# Altium project opo.PrjPcb
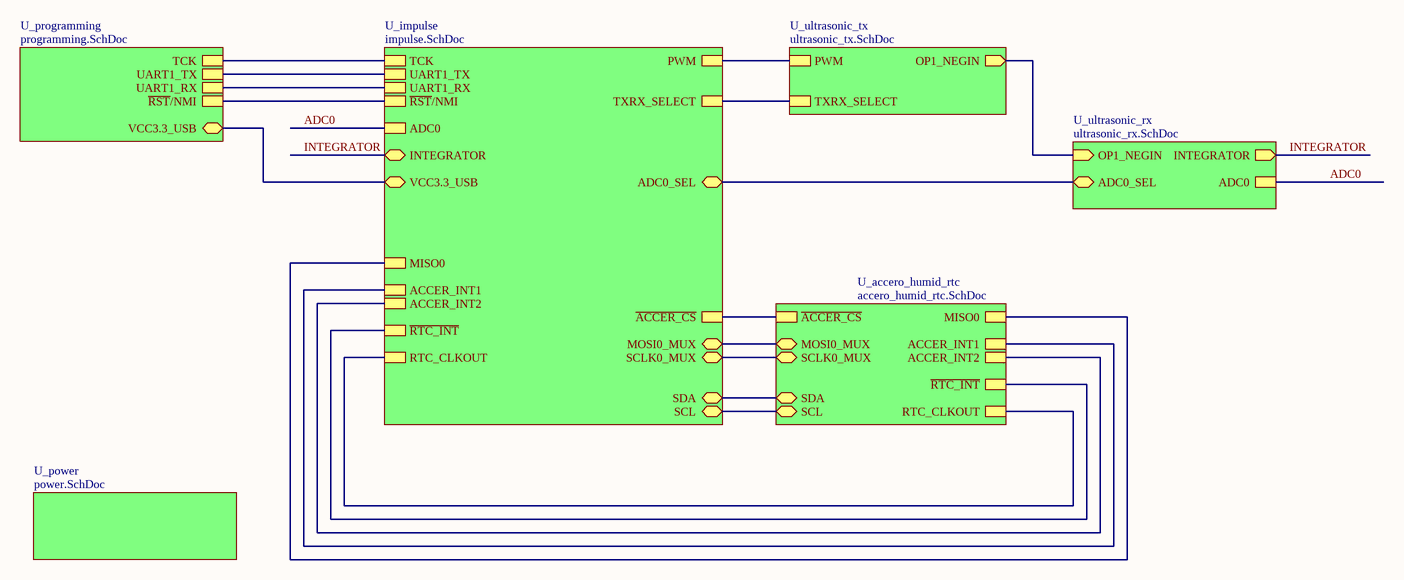
[diagram p0: opo_v4.1.SchDoc]
7 sheets, 106 parts. Net scope: hierarchical (ports join the sheet entries above them; power ports are global).
Board file: opo_v4.1.PcbDoc
Sheets:
  opo_v4.1.SchDoc
    U_impulse = impulse.SchDoc
    U_accero_humid_rtc = accero_humid_rtc.SchDoc
    U_power = power.SchDoc
    U_programming = programming.SchDoc
    U_ultrasonic_rx = ultrasonic_rx.SchDoc
    U_ultrasonic_tx = ultrasonic_tx.SchDoc

## Sheet opo_v4.1.SchDoc: OPO
size Letter; Author: Kuo, Huang; Revision: 4.0; SheetNumber: 3; SheetTotal: 7

### Sub-sheets
U_accero_humid_rtc = accero_humid_rtc.SchDoc: ~{ACCER_CS}, MISO0, ACCER_INT1, ACCER_INT2, ~{RTC_INT}, RTC_CLKOUT, SDA, SCL, MOSI0_MUX, SCLK0_MUX
U_impulse = impulse.SchDoc: TCK, UART1_TX, UART1_RX, ~{RST}/NMI, ADC0, TXRX_SELECT, PWM, ~{ACCER_CS}, MISO0, ACCER_INT1, ACCER_INT2, ~{RTC_INT}, RTC_CLKOUT, INTEGRATOR, ADC0_SEL, SDA, SCL, MOSI0_MUX, SCLK0_MUX, VCC3.3_USB
U_power = power.SchDoc: no entries
U_programming = programming.SchDoc: TCK, UART1_TX, UART1_RX, ~{RST}/NMI, VCC3.3_USB
U_ultrasonic_rx = ultrasonic_rx.SchDoc: ADC0, OP1_NEGIN (in), INTEGRATOR (out), ADC0_SEL
U_ultrasonic_tx = ultrasonic_tx.SchDoc: PWM, OP1_NEGIN (out), TXRX_SELECT

### Nets
ADC0: sheet U_impulse/ADC0, sheet U_ultrasonic_rx/ADC0
INTEGRATOR: sheet U_impulse/INTEGRATOR, sheet U_ultrasonic_rx/INTEGRATOR
MISO0: sheet U_impulse/MISO0, sheet U_accero_humid_rtc/MISO0
MOSI0_MUX: sheet U_impulse/MOSI0_MUX, sheet U_accero_humid_rtc/MOSI0_MUX
OP1_NEGIN: sheet U_ultrasonic_rx/OP1_NEGIN, sheet U_ultrasonic_tx/OP1_NEGIN
~{RST}/NMI: sheet U_impulse/~{RST}/NMI, sheet U_programming/~{RST}/NMI
SCL: sheet U_impulse/SCL, sheet U_accero_humid_rtc/SCL
SCLK0_MUX: sheet U_impulse/SCLK0_MUX, sheet U_accero_humid_rtc/SCLK0_MUX
SDA: sheet U_impulse/SDA, sheet U_accero_humid_rtc/SDA
TCK: sheet U_impulse/TCK, sheet U_programming/TCK
UART1_RX: sheet U_impulse/UART1_RX, sheet U_programming/UART1_RX
UART1_TX: sheet U_impulse/UART1_TX, sheet U_programming/UART1_TX
VCC3.3_USB: sheet U_impulse/VCC3.3_USB, sheet U_programming/VCC3.3_USB
NetU1_8: sheet U_impulse/~{ACCER_CS}, sheet U_accero_humid_rtc/~{ACCER_CS}
NetU1_9: sheet U_impulse/ACCER_INT2, sheet U_accero_humid_rtc/ACCER_INT2
NetU1_11: sheet U_impulse/ACCER_INT1, sheet U_accero_humid_rtc/ACCER_INT1
NetU4_2: sheet U_impulse/ADC0_SEL, sheet U_ultrasonic_rx/ADC0_SEL
NetU4_8: sheet U_impulse/RTC_CLKOUT, sheet U_accero_humid_rtc/RTC_CLKOUT
NetU4_18: sheet U_impulse/PWM, sheet U_ultrasonic_tx/PWM
NetU4_39: sheet U_impulse/~{RTC_INT}, sheet U_accero_humid_rtc/~{RTC_INT}
NetU4_44: sheet U_impulse/TXRX_SELECT, sheet U_ultrasonic_tx/TXRX_SELECT

### Notes on the sheet
- Title
- Date:
- Author:
- Revision:
- Sheet
- of
- University of Michigan
- File:

## Sheet impulse.SchDoc: OPO
size Letter; Author: Kuo, Huang; Revision: 4.0; SheetNumber: 2; SheetTotal: 7
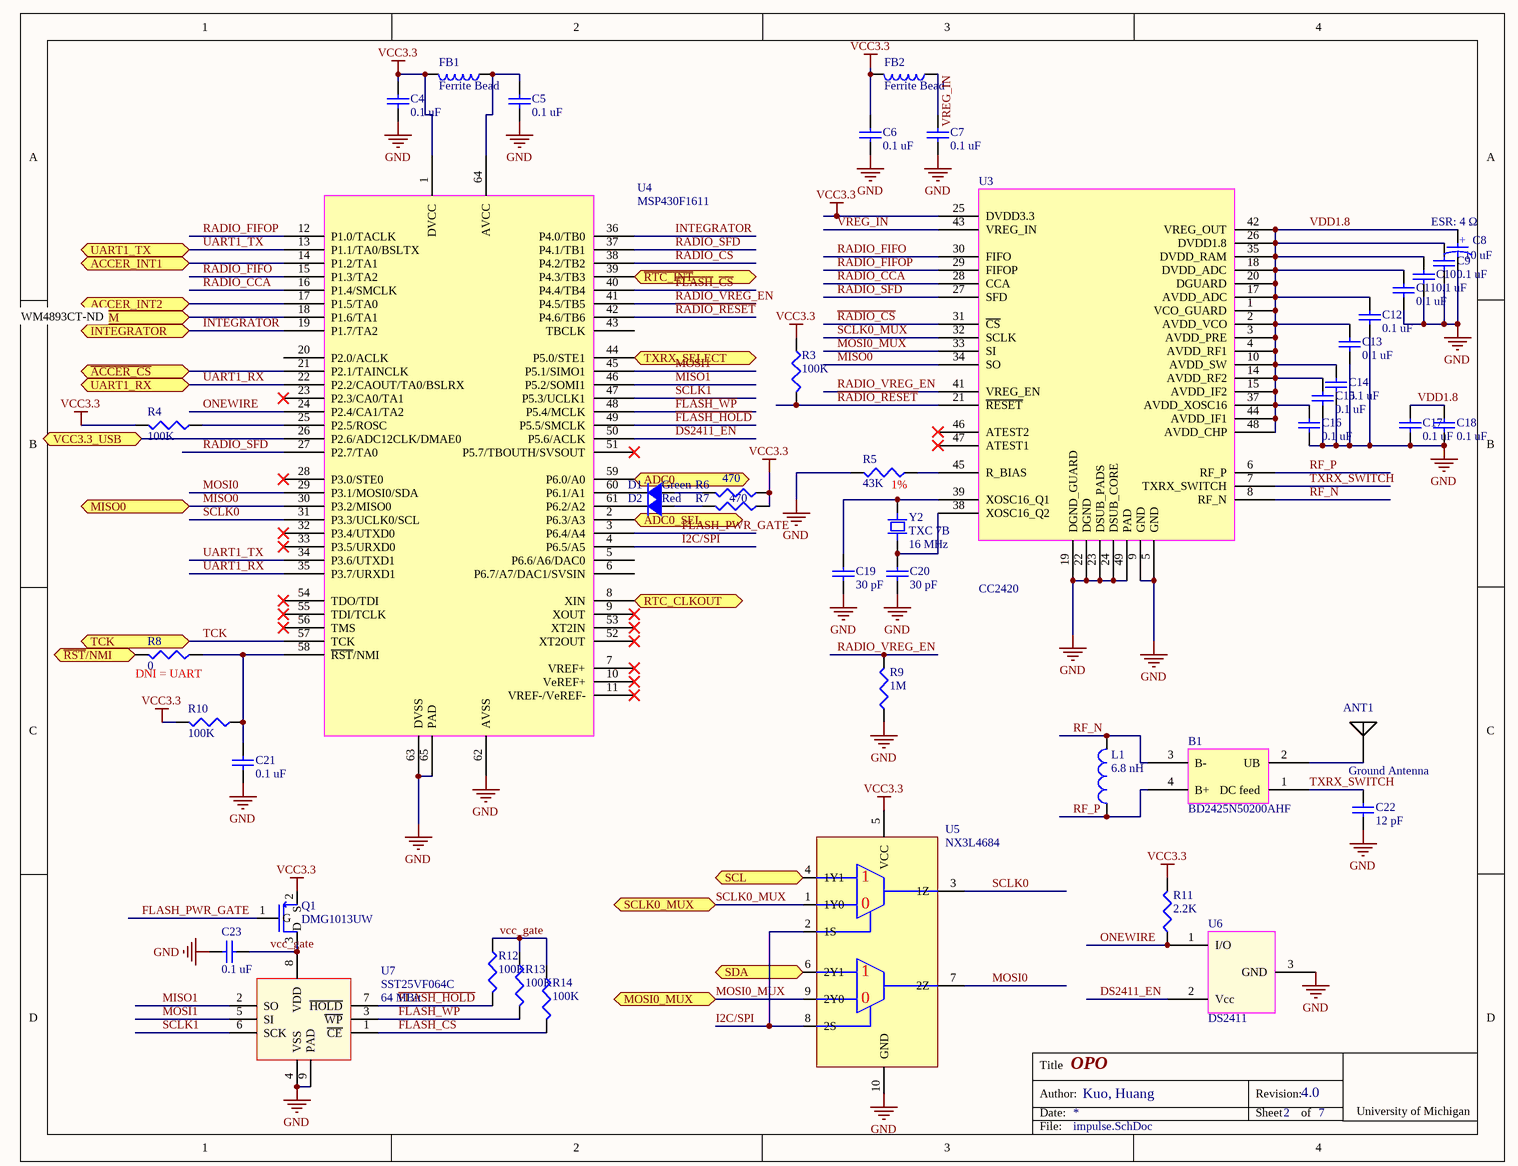
[diagram p1: impulse.SchDoc]

### Parts
ANT1  Ground Antenna  [Chip Antenna]
B1  BD2425N50200AHF  [BD2425N50200AHF]
C4  value 0.1 uF  [0402]  (hidden comment: Ceramic capacitor)
C5  value 0.1 uF  [0402]  (hidden comment: Ceramic capacitor)
C6  value 0.1 uF  [0402]  (hidden comment: Ceramic capacitor)
C7  value 0.1 uF  [0402]  (hidden comment: Ceramic capacitor)
C8  value 10 uF  ESR: 4 Ω  [0603 - Polar Marking]  (hidden comment: Tantalum capacitor)
C9  value 0.1 uF  [0402]  (hidden comment: Ceramic capacitor)
C10  value 0.1 uF  [0402]  (hidden comment: Ceramic capacitor)
C11  value 0.1 uF  [0402]  (hidden comment: Ceramic capacitor)
C12  value 0.1 uF  [0402]  (hidden comment: Ceramic capacitor)
C13  value 0.1 uF  [0402]  (hidden comment: Ceramic capacitor)
C14  value 0.1 uF  [0402]  (hidden comment: Ceramic capacitor)
C15  value 0.1 uF  [0402]  (hidden comment: Ceramic capacitor)
C16  value 0.1 uF  [0402]  (hidden comment: Ceramic capacitor)
C17  value 0.1 uF  [0402]  (hidden comment: Ceramic capacitor)
C18  value 0.1 uF  [0402]  (hidden comment: Ceramic capacitor)
C19  value 30 pF  [0402]  (hidden comment: Ceramic capacitor)
C20  value 30 pF  [0402]  (hidden comment: Ceramic capacitor)
C21  value 0.1 uF  [0402]  (hidden comment: Ceramic capacitor)
C22  value 12 pF  [0402]  (hidden comment: Ceramic capacitor)
C23  value 0.1 uF  [0402]  (hidden comment: Ceramic capacitor)
D1  Color: Green  [0402 - DIODE]  (hidden comment: LED, Green)
D2  Color: Red  [0402 - DIODE]  (hidden comment: LED, Red)
FB1  Ferrite Bead  [0402]
FB2  Ferrite Bead  [0402]
L1  value 6.8 nH  [0402]  (hidden comment: Chip inductor)
Q1  DMG1013UW  [SC70-3]
R3  value 100K  [0402]  (hidden comment: Chip resistor)
R4  value 100K  [0402]  (hidden comment: Chip resistor)
R5  value 43K  [0402]  (hidden comment: Chip resistor)
R6  value 470  [0402]  (hidden comment: Chip resistor)
R7  value 470  [0402]  (hidden comment: Chip resistor)
R8  value 0  [0402]  (hidden comment: Chip resistor)
R9  value 1M  [0402]  (hidden comment: Chip resistor)
R10  value 100K  [0402]  (hidden comment: Chip resistor)
R11  value 2.2K  [0402]  (hidden comment: Chip resistor)
R12  value 100K  [0402]  (hidden comment: Chip resistor)
R13  value 100K  [0402]  (hidden comment: Chip resistor)
R14  value 100K  [0402]  (hidden comment: Chip resistor)
U3  CC2420  [QFN50P700X700X100_HS-49N]
U4  MSP430F1611  [QFN50P900X900X90_HS-65N]
U5  NX3L4684  [QFN50P155X200X13-10N]
U6  DS2411  [SOT23-3N]
U7  SST25VF064C  Capacity: 64 MBit  [WSON]
Y2  TXC 7B  frequency: 16 MHz  [TXC 7B]

### Ports
ACCER_INT1, ACCER_INT2, ADC0, ADC0_SEL, INTEGRATOR, MISO0, MOSI0_MUX, PWM, RTC_CLKOUT, SCL, SCLK0_MUX, SDA, TCK, TXRX_SELECT, UART1_RX, UART1_TX, VCC3.3_USB, ~{ACCER_CS}, ~{RST}/NMI, ~{RTC_INT}

### Nets
GND: C4.2 C5.2 C6.2 C7.2 C8.2 C9.2 C10.2 C11.2 C12.2 C13.2 C14.2 C15.2 C16.2 C17.2 C18.2 C19.1 C20.1 C21.2 C22.2 C23.2 R5.1 R9.2 U3.5(GND) U3.9(GND) U3.19(DGND_GUARD) U3.22(DGND) U3.23(DSUB_PADS) U3.24(DSUB_CORE) U3.49(PAD) U4.62(AVSS) U4.63(DVSS) U4.65(PAD) U5.10(GND) U6.3(GND) U7.4(VSS) U7.9(PAD)
VCC3.3: C4.1 C6.1 FB1.1 FB2.1 Q1.2(S) R3.2 R4.1 R6.2 R7.2 R10.1 R11.1 U3.25(DVDD3.3) U4.1(DVCC) U5.5(VCC)
ADC0: U4.59(P6.0/A0) ; port ADC0
DS2411_EN: U4.50(P5.6/ACLK) U6.2(Vcc)
~{FLASH_HOLD}: R12.1 U4.49(P5.5/SMCLK) U7.7(~{HOLD})
~{FLASH_WP}: R13.1 U4.48(P5.4/MCLK) U7.3(~{WP})
~{FLASH}_~{CS}: R14.1 U4.40(P4.4/TB4) U7.1(~{CE})
FLASH_PWR_GATE: Q1.1(G) U4.3(P6.4/A4)
I2C/SPI: U4.4(P6.5/A5) U5.2(1S) U5.8(2S)
INTEGRATOR: U4.19(P1.7/TA2) U4.36(P4.0/TB0) ; port INTEGRATOR
MISO0: U3.34(SO) U4.30(P3.2/MISO0) ; port MISO0
MISO1: U4.46(P5.2/SOMI1) U7.2(SO)
MOSI0: U4.29(P3.1/MOSI0/SDA) U5.7(2Z)
MOSI0_MUX: U3.33(SI) U5.9(2Y0) ; port MOSI0_MUX
MOSI1: U4.45(P5.1/SIMO1) U7.5(SI)
ONEWIRE: R11.2 U4.24(P2.4/CA1/TA2) U6.1(I/O)
~{RADIO_CS}: U3.31(~{CS}) U4.38(P4.2/TB2)
~{RADIO_RESET}: R3.1 U3.21(~{RESET}) U4.42(P4.6/TB6)
~{RST}/NMI: R8.1 ; port ~{RST}/NMI
RADIO_CCA: U3.28(CCA) U4.16(P1.4/SMCLK)
RADIO_FIFO: U3.30(FIFO) U4.15(P1.3/TA2)
RADIO_FIFOP: U3.29(FIFOP) U4.12(P1.0/TACLK)
RADIO_SFD: U3.27(SFD) U4.27(P2.7/TA0) U4.37(P4.1/TB1)
RADIO_VREG_EN: R9.1 U3.41(VREG_EN) U4.41(P4.5/TB5)
RF_N: B1.3(B-) L1.1 U3.8(RF_N)
RF_P: B1.4(B+) L1.2 U3.6(RF_P)
SCL: U5.4(1Y1) ; port SCL
SCLK0: U4.31(P3.3/UCLK0/SCL) U5.3(1Z)
SCLK0_MUX: U3.32(SCLK) U5.1(1Y0) ; port SCLK0_MUX
SCLK1: U4.47(P5.3/UCLK1) U7.6(SCK)
SDA: U5.6(2Y1) ; port SDA
TCK: U4.57(TCK) ; port TCK
TXRX_SWITCH: B1.1(DC_feed) C22.1 U3.7(TXRX_SWITCH)
UART1_RX: U4.22(P2.2/CAOUT/TA0/BSLRX) U4.35(P3.7/URXD1) ; port UART1_RX
UART1_TX: U4.13(P1.1/TA0/BSLTX) U4.34(P3.6/UTXD1) ; port UART1_TX
VCC3.3_USB: U4.26(P2.6/ADC12CLK/DMAE0) ; port VCC3.3_USB
vcc_gate: C23.1 Q1.3(D) R12.2 R13.2 R14.2 U7.8(VDD)
VDD1.8: C8.1 C9.1 C10.1 C11.1 C12.1 C13.1 C14.1 C15.1 C16.1 C17.1 C18.1 U3.1(VCO_GUARD) U3.2(AVDD_VCO) U3.3(AVDD_PRE) U3.4(AVDD_RF1) U3.10(AVDD_SW) U3.14(AVDD_RF2) U3.15(AVDD_IF2) U3.17(AVDD_ADC) U3.18(DVDD_ADC) U3.20(DGUARD) U3.26(DVDD1.8) U3.35(DVDD_RAM) U3.37(AVDD_XOSC16) U3.42(VREG_OUT) U3.44(AVDD_IF1) U3.48(AVDD_CHP)
VREG_IN: C7.1 FB2.2 U3.43(VREG_IN)
NetANT1_1: ANT1.1 B1.2(UB)
NetC5_1: C5.1 FB1.2 U4.64(AVCC)
NetC19_2: C19.2 U3.39(XOSC16_Q1) Y2.1
NetC20_2: C20.2 U3.38(XOSC16_Q2) Y2.3
NetC21_1: C21.1 R8.2 R10.2 U4.58(~{RST}/NMI)
NetD1_1: D1.1 R6.1
NetD1_2: D1.2 U4.60(P6.1/A1)
NetD2_1: D2.1 R7.1
NetD2_2: D2.2 U4.61(P6.2/A2)
NetR4_2: R4.2 U4.25(P2.5/ROSC)
NetR5_2: R5.2 U3.45(R_BIAS)
NetU1_8: U4.21(P2.1/TAINCLK) ; port ~{ACCER_CS}
NetU1_9: U4.17(P1.5/TA0) ; port ACCER_INT2
NetU1_11: U4.14(P1.2/TA1) ; port ACCER_INT1
NetU4_2: U4.2(P6.3/A3) ; port ADC0_SEL
NetU4_8: U4.8(XIN) ; port RTC_CLKOUT
NetU4_18: U4.18(P1.6/TA1) ; port PWM
NetU4_39: U4.39(P4.3/TB3) ; port ~{RTC_INT}
NetU4_44: U4.44(P5.0/STE1) ; port TXRX_SELECT

Not connected (* = marked no-connect by the designer): U3 46(ATEST2)* 47(ATEST1)*; U4 5(P6.6/A6/DAC0) 6(P6.7/A7/DAC1/SVSIN) 7(VREF+)* 9(XOUT)* 10(VeREF+)* 11(VREF-/VeREF-)* 20(P2.0/ACLK) 23(P2.3/CA0/TA1)* 28(P3.0/STE0)* 32(P3.4/UTXD0)* 33(P3.5/URXD0)* 43(TBCLK) 51(P5.7/TBOUTH/SVSOUT)* 52(XT2OUT)* 53(XT2IN)* 54(TDO/TDI)* 55(TDI/TCLK)* 56(TMS)*

### Notes on the sheet
- WM4893CT-ND
- (near R5) 1%
- (near R8) DNI = UART
- Title
- Date:
- Author:
- Revision:
- Sheet
- of
- University of Michigan
- File:
- (in symbol C_10u_0603_tantalum) +
- (in symbol NX3L4684) 0

### Library data of the parts
ANT1 = Ground Antenna: 2.4GHz Surface Mount Device (SMD) On Ground Antenna, 50 Ohms; Supplier 1: Digi-Key; Supplier Part Number 1: WM4893CT-ND
B1 = BD2425N50200AHF: Ultra Low Profile 0404 Balun   50Ω to 200Ω Balanced; Supplier 1: Digi-Key; Supplier Part Number 1: 1173-1063-1-ND
C4-C7 C9-C18 C21 C23 = C_0.1u_0402_ceramic: Ceramic capacitor, 0.1u, 0402 package; Manufacture: TDK; voltage rated: 10 V; tolerance: 10%; Supplier 1: Digi-Key; Supplier Part Number 1: 445-1265-1-ND; package: 0402
C8 = C_10u_0603_tantalum: Tantalum capacitor, 10 uF, 0603 package; Manufacture: AVX; voltage rated: 6.3V; tolerance: 10%; package: 0603; Supplier 1: Digi-Key; Supplier Part Number 1: 478-4959-1-ND
C19 C20 = C_30p_0402_ceramic: Ceramic capacitor, 30 pF, 0402 package; Manufacture: Johanson; voltage rated: 50 V; tolerance: 2%; package: 0402; Supplier 1: Digi-Key; Supplier Part Number 1: 712-1295-1-ND
C22 = C_12p_0402_ceramic: Ceramic capacitor, 12 pF, 0402 package; Manufacture: Johanson; voltage rated: 50 V; tolerance: 2%; package: 0402; Supplier 1: Digi-Key; Supplier Part Number 1: 712-1256-1-ND
D1 = D_LED_GREEN_0402: LED, Green,  0402; package: 0402; Supplier 1: Digi-Key; Supplier Part Number 1: 511-1592-1-ND
D2 = D_LED_RED_0402: LED, Red, 0402; package: 0402; Supplier 1: Digi-Key; Supplier Part Number 1: 511-1593-1-ND
FB1 FB2 = FB_150mA_0402: Ferrite Bead, 150 mA, 0402 package; impedance@Freq: 1K@100 MHz; current rating: 150 mA; Supplier 1: Digi-Key; Supplier Part Number 1: 587-1835-1-ND; package: 0402
L1 = L_6.8n_0402: Chip inductor, 6.8 nH, 0402 package; tolerance: 5%; package: 0402; Supplier 1: Digi-Key; Supplier Part Number 1: 712-1419-1-ND
Q1 = DMG1013UW: P-CHANNEL ENHANCEMENT MODE MOSFET; Supplier 1: Digi-Key; Supplier Part Number 1: DMG1013UW-7DICT-ND
R3 R4 R10 R12-R14 = R_100K_0402: Chip resistor, 100K, 0402 package; tolerance: 1%; power: 1/16 W; Supplier 1: Digi-Key; Supplier Part Number 1: 541-100KLCT-ND; package: 0402
R5 = R_43K_0402: Chip resistor, 43K, 0402 package; tolerance: 1%; power: 1/16 W; Supplier 1: Digi-Key; Supplier Part Number 1: 541-43.0KLCT-ND; package: 0402
R6 R7 = R_470_0402: Chip resistor, 470, 0402 package; tolerance: 1%; power: 1/16 W; Supplier 1: Digi-Key; Supplier Part Number 1: 541-470LCT-ND; package: 0402
R8 = R_0_0402: Chip resistor, 0, 0402 package; package: 0402; Supplier 1: Digi-Key; Supplier Part Number 1: 541-0.0YBCT-ND
R9 = R_1M_0402: Chip resistor, 1M, 0402 package; tolerance: 1%; power: 1/16 W; Supplier 1: Digi-Key; Supplier Part Number 1: 541-1.00MLCT-ND; package: 0402
R11 = R_2.2K_0402: Chip resistor, 2.2K, 0402 package; tolerance: 1%; power: 1/16 W; package: 0402; Supplier 1: Digi-Key; Supplier Part Number 1: 541-2.20KLCT-ND
U3 = CC2420: 2.4 GHz IEEE 802.15.4 / ZigBee-ready RF Transceiver; Supplier 1: Digi-Key; Supplier Part Number 1: 296-19585-1-ND
U4 = MSP430F1611: MIXED SIGNAL MICROCONTROLLER; Supplier 1: Digi-Key; Supplier Part Number 1: 296-18102-1-ND
U5 = NX3L4684: IC ANALOG SWITCH SPDT 10XQFN; Supplier 1: Digi-Key; Supplier Part Number 1: 568-5564-1-ND
U6 = DS2411: Silicon Serial Number with VCC Input; Supplier 1: Digi-Key; Supplier Part Number 1: DS2411R+CT-ND
U7 = SST25VF064C: 64 Mbit SPI Serial Dual I/O Flash; Supplier 1: Digi-Key; Supplier Part Number 1: SST25VF064C-80-4I-Q2AE-CT-ND
Y2 = TXC 7B: 5 x 3.2 mm SMD SEAM CRYSTAL 7B SERIES; Load capatance: 18 pF; ESR: 40; stability: 30 ppm; Supplier 1: Digi-Key; Supplier Part Number 1: 887-1104-1-ND

## Sheet accero_humid_rtc.SchDoc: OPO
size Letter; Author: Kuo, Huang; Revision: 4.0; SheetNumber: 1; SheetTotal: 7
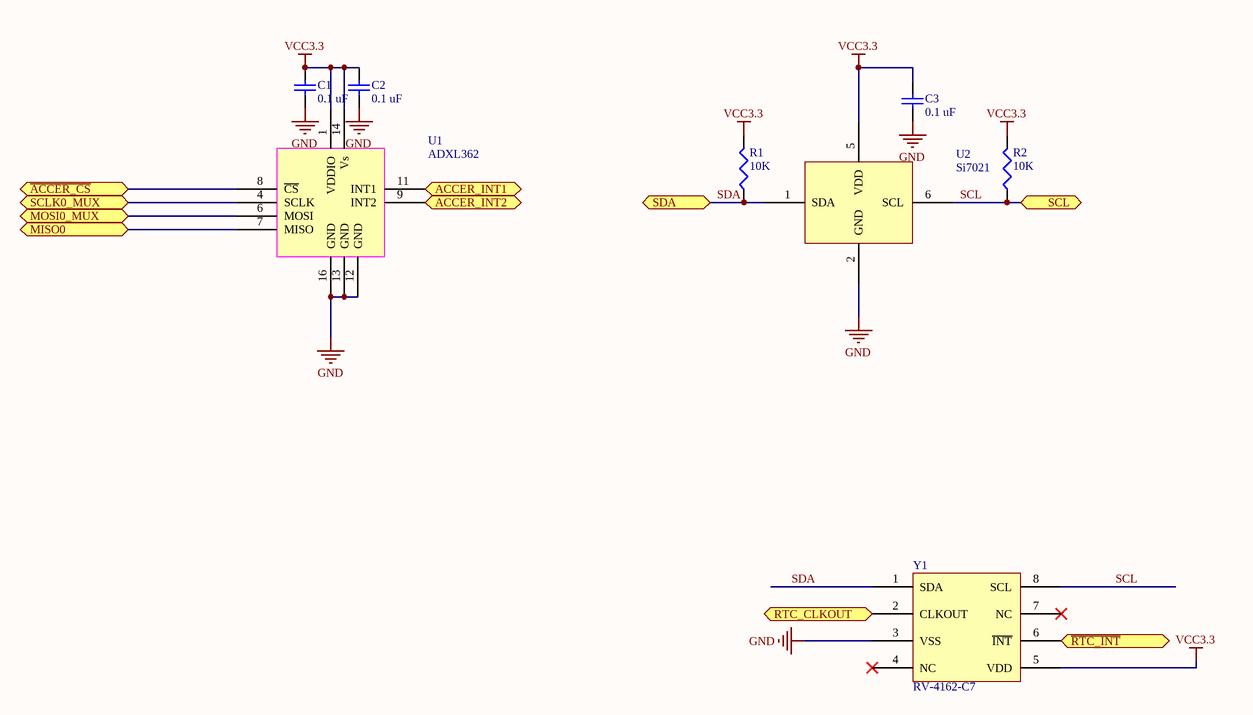
[diagram p2: accero_humid_rtc.SchDoc]

### Parts
C1  value 0.1 uF  [0402]  (hidden comment: Ceramic capacitor)
C2  value 0.1 uF  [0402]  (hidden comment: Ceramic capacitor)
C3  value 0.1 uF  [0402]  (hidden comment: Ceramic capacitor)
R1  value 10K  [0402]  (hidden comment: Chip resistor)
R2  value 10K  [0402]  (hidden comment: Chip resistor)
U1  ADXL362  [LGA_CC-16-4]
U2  Si7021  [DFN6-Si7021]
Y1  RV-4162-C7  [RV4162]

### Ports
ACCER_INT1, ACCER_INT2, MISO0, MOSI0_MUX, RTC_CLKOUT, SCL, SCLK0_MUX, SDA, ~{ACCER_CS}, ~{RTC_INT}

### Nets
GND: C1.2 C2.2 C3.2 U1.12(GND) U1.13(GND) U1.16(GND) U2.2(GND) Y1.3(VSS)
VCC3.3: C1.1 C2.1 C3.1 R1.1 R2.1 U1.1(VDDIO) U1.14(Vs) U2.5(VDD) Y1.5(VDD)
MISO0: U1.7(MISO) ; port MISO0
MOSI0_MUX: U1.6(MOSI) ; port MOSI0_MUX
SCL: R2.2 U2.6(SCL) Y1.8(SCL) ; port SCL
SCLK0_MUX: U1.4(SCLK) ; port SCLK0_MUX
SDA: R1.2 U2.1(SDA) Y1.1(SDA) ; port SDA
NetU1_8: U1.8(~{CS}) ; port ~{ACCER_CS}
NetU1_9: U1.9(INT2) ; port ACCER_INT2
NetU1_11: U1.11(INT1) ; port ACCER_INT1
NetU4_8: Y1.2(CLKOUT) ; port RTC_CLKOUT
NetU4_39: Y1.6(~{INT}) ; port ~{RTC_INT}

Not connected (* = marked no-connect by the designer): U2 3(DNC) 4(DNC) 7(DNC); Y1 4(NC)* 7(NC)*

### Notes on the sheet
- Title
- Date:
- Author:
- Revision:
- Sheet
- of
- University of Michigan
- File:

### Library data of the parts
C1-C3 = C_0.1u_0402_ceramic: as C4 on sheet impulse; Supplier 1: Digi-Key; Supplier Part Number 1: 445-1265-1-ND; package: 0402
R1 R2 = R_10K_0402: Chip resistor, 10K, 0402 package; tolerance: 1%; power: 1/16 W; Supplier 1: Digi-Key; Supplier Part Number 1: 541-10.0KLDKR-ND; package: 0402
U1 = ADXL362: Micropower, 3-Axis, ±2 g/±4 g/±8 g  Digital Output MEMS Accelerometer; Supplier 1: Digi-Key; Supplier Part Number 1: ADXL362BCCZ-RL7CT-ND
U2 = Si7021: Temperature and Humidity Sensor; Supplier 1: Digikey; Supplier Part Number 1: 336-2542-1-ND
Y1 = RV-4162-C7: Real Time Clock Module with I2C Bus; Supplier 1: Newark; Supplier Part Number 1: 09X0517

## Sheet power.SchDoc: OPO
size Letter; Author: Kuo, Huang; Revision: 4.0; SheetNumber: 4; SheetTotal: 7
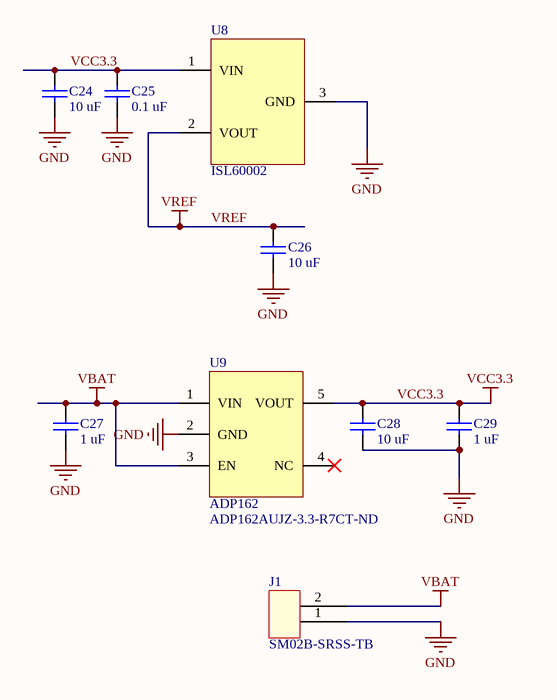
[diagram p3: power.SchDoc]

### Parts
C24  value 10 uF  [0603]  (hidden comment: Ceramic capacitor)
C25  value 0.1 uF  [0402]  (hidden comment: Ceramic capacitor)
C26  value 10 uF  [0603]  (hidden comment: Ceramic capacitor)
C27  value 1 uF  [0402]  (hidden comment: Ceramic capacitor)
C28  value 10 uF  [0603]  (hidden comment: Ceramic capacitor)
C29  value 1 uF  [0402]  (hidden comment: Ceramic capacitor)
J1  SM02B-SRSS-TB  [JST SH series]
U8  ISL60002  [SOT23-3N]
U9  ADP162  Supplier Part Number 1: ADP162AUJZ-3.3-R7CT-ND  [TSOT23-5]

### Nets
GND: C24.2 C25.2 C26.2 C27.2 C28.2 C29.2 J1.1 U8.3(GND) U9.2(GND)
VBAT: C27.1 J1.2 U9.1(VIN) U9.3(EN)
VCC3.3: C24.1 C25.1 C28.1 C29.1 U8.1(VIN) U9.5(VOUT)
VREF: C26.1 U8.2(VOUT)

Not connected (* = marked no-connect by the designer): U9 4(NC)*

### Notes on the sheet
- Title
- Date:
- Author:
- Revision:
- Sheet
- of
- University of Michigan
- File:

### Library data of the parts
C24 C26 C28 = C_10u_0603_ceramic: Ceramic capacitor, 10 uF, 0603 package; Manufacture: TDK; voltage rated: 6.3V; tolerance: 20%; package: 0603; Supplier 1: Digi-Key; Supplier Part Number 1: 445-4112-1-ND
C25 = C_0.1u_0402_ceramic: as C4 on sheet impulse; Supplier 1: Digi-Key; Supplier Part Number 1: 445-1265-1-ND; package: 0402
C27 C29 = C_1u_0402_ceramic: Ceramic capacitor, 1 uF, 0402 package; Manufacture: TDK; voltage rated: 6.3 V; tolerance: 10%; package: 0402; Supplier 1: Digi-Key; Supplier Part Number 1: 445-5000-1-ND
J1 = SM02B-SRSS-TB: CONN HEADER SH 2POS SIDE 1MM TIN; Supplier 1: Digi-Key; Supplier Part Number 1: 455-1802-1-ND
U8 = ISL60002: IC VREF SERIES PREC SOT-23-3; Supplier 1: Digi-Key; Supplier Part Number 1: ISL60002DIH310Z-TKCT-ND
U9 = ADP162: Ultralow Quiescent Current,  150 mA, CMOS Linear Regulators; Supplier 1: Digi-Key

## Sheet programming.SchDoc: OPO
size Letter; Author: Kuo, Huang; Revision: 4.0; SheetNumber: 5; SheetTotal: 7
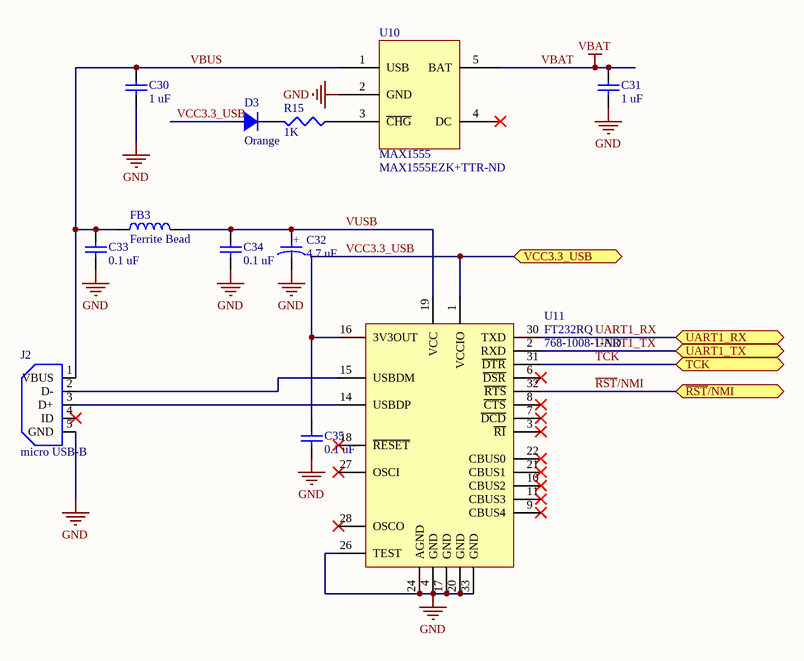
[diagram p4: programming.SchDoc]

### Parts
C30  value 1 uF  [0402]  (hidden comment: Ceramic capacitor)
C31  value 1 uF  [0402]  (hidden comment: Ceramic capacitor)
C32  value 4.7 uF  [0603 - Polar Marking]  (hidden comment: Tantalum capacitor)
C33  value 0.1 uF  [0402]  (hidden comment: Ceramic capacitor)
C34  value 0.1 uF  [0402]  (hidden comment: Ceramic capacitor)
C35  value 0.1 uF  [0402]  (hidden comment: Ceramic capacitor)
D3  Color: Orange  [0402 - DIODE]  (hidden comment: LED, Orange)
FB3  Ferrite Bead  [0402]
J2  micro USB-B  [Micro USB-B]
R15  value 1K  [0402]  (hidden comment: Chip resistor)
U10  MAX1555  Supplier Part Number 1: MAX1555EZK+TTR-ND  [SOT23-5]
U11  FT232RQ  Supplier Part Number 1: 768-1008-1-ND  [QFN-32]

### Ports
TCK, UART1_RX, UART1_TX, VCC3.3_USB, ~{RST}/NMI

### Nets
GND: C30.2 C31.2 C32.2 C33.2 C34.2 C35.2 J2.5(GND) U10.2(GND) U11.4(GND) U11.17(GND) U11.20(GND) U11.24(AGND) U11.26(TEST) U11.33(GND)
VBAT: C31.1 U10.5(BAT)
~{RST}/NMI: U11.32(~{RTS}) ; port ~{RST}/NMI
TCK: U11.31(~{DTR}) ; port TCK
UART1_RX: U11.30(TXD) ; port UART1_RX
UART1_TX: U11.2(RXD) ; port UART1_TX
VBUS: C30.1 C33.1 FB3.2 J2.1(VBUS) U10.1(USB)
VCC3.3_USB: C35.1 D3.1 U11.1(VCCIO) U11.16(3V3OUT) ; port VCC3.3_USB
VUSB: C32.1 C34.1 FB3.1 U11.19(VCC)
NetD3_2: D3.2 R15.1
NetJ2_2: J2.2(D-) U11.15(USBDM)
NetJ2_3: J2.3(D+) U11.14(USBDP)
NetR15_2: R15.2 U10.3(~{CHG})

Not connected (* = marked no-connect by the designer): J2 4(ID)*; U10 4(DC)*; U11 3(~{RI})* 6(~{DSR})* 7(~{DCD})* 8(~{CTS})* 9(CBUS4)* 10(CBUS2)* 11(CBUS3)* 18(~{RESET})* 21(CBUS1)* 22(CBUS0)* 27(OSCI)* 28(OSCO)*

### Notes on the sheet
- Title
- Date:
- Author:
- Revision:
- Sheet
- of
- University of Michigan
- File:
- (in symbol C_4.7u_0603_tantalum) +

### Library data of the parts
C30 C31 = C_1u_0402_ceramic: as C27 on sheet power; package: 0402; Supplier 1: Digi-Key; Supplier Part Number 1: 445-5000-1-ND
C32 = C_4.7u_0603_tantalum: Tantalum capacitor, 4.7 uF, 0603 package; Manufacture: Rohm; voltage rated: 10 V; tolerance: 20%; package: 0603; Supplier 1: Digi-Key; Supplier Part Number 1: 511-1496-1-ND
C33-C35 = C_0.1u_0402_ceramic: as C4 on sheet impulse; Supplier 1: Digi-Key; Supplier Part Number 1: 445-1265-1-ND; package: 0402
D3 = D_LED_ORANGE_0402: LED, Orange, 0402; Supplier 1: Digi-Key; Supplier Part Number 1: 511-1590-1-ND; package: 0402
FB3 = FB_150mA_0402: as FB1 on sheet impulse; Supplier 1: Digi-Key; Supplier Part Number 1: 587-1835-1-ND; package: 0402
J2 = Micro USB: CONN USB MICRO B RECPT SMT R/A; Supplier 1: Digi-Key; Supplier Part Number 1: 609-4616-6-ND
R15 = R_1K_0402: Chip resistor, 1K, 0402 package; tolerance: 1%; power: 1/16 W; Supplier 1: Digi-Key; Supplier Part Number 1: 541-1.00KLCT-ND; package: 0402
U10 = MAX1555: 3 Dual-Input USB/AC Adapter 1-Cell Li+  Battery Chargers; Supplier 1: Digi-Key
U11 = IC_FT232RQ: FT232R USB UART; Manufacturer: *; Note: *; ManufacturerPartNo: *; Supplier 1: Digi-Key

## Sheet ultrasonic_rx.SchDoc: OPO
size Letter; Author: Kuo, Huang; Revision: 4.0; SheetNumber: 6; SheetTotal: 7
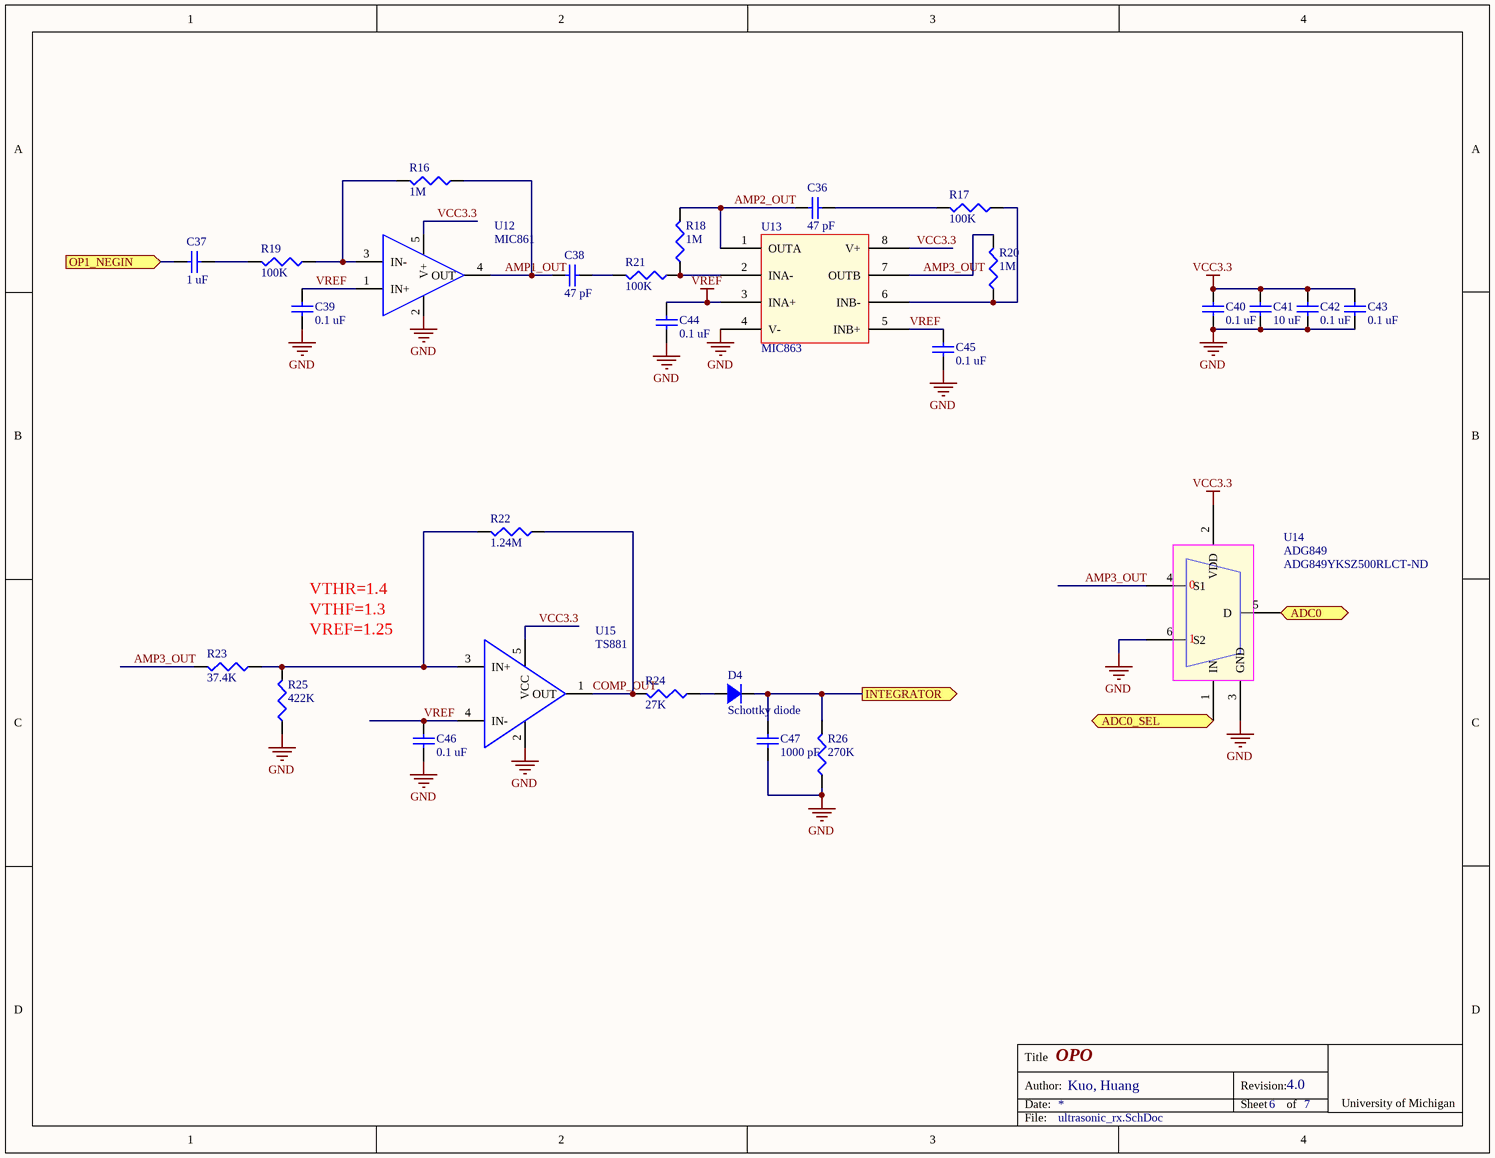
[diagram p5: ultrasonic_rx.SchDoc]

### Parts
C36  value 47 pF  [0402]  (hidden comment: Ceramic capacitor)
C37  value 1 uF  [0402]  (hidden comment: Ceramic capacitor)
C38  value 47 pF  [0402]  (hidden comment: Ceramic capacitor)
C39  value 0.1 uF  [0402]  (hidden comment: Ceramic capacitor)
C40  value 0.1 uF  [0402]  (hidden comment: Ceramic capacitor)
C41  value 10 uF  [0603]  (hidden comment: Ceramic capacitor)
C42  value 0.1 uF  [0402]  (hidden comment: Ceramic capacitor)
C43  value 0.1 uF  [0402]  (hidden comment: Ceramic capacitor)
C44  value 0.1 uF  [0402]  (hidden comment: Ceramic capacitor)
C45  value 0.1 uF  [0402]  (hidden comment: Ceramic capacitor)
C46  value 0.1 uF  [0402]  (hidden comment: Ceramic capacitor)
C47  value 1000 pF  [0402]  (hidden comment: Ceramic capacitor)
D4  Schottky diode  [0603 - DIODE]
R16  value 1M  [0402]  (hidden comment: Chip resistor)
R17  value 100K  [0402]  (hidden comment: Chip resistor)
R18  value 1M  [0402]  (hidden comment: Chip resistor)
R19  value 100K  [0402]  (hidden comment: Chip resistor)
R20  value 1M  [0402]  (hidden comment: Chip resistor)
R21  value 100K  [0402]  (hidden comment: Chip resistor)
R22  value 1.24M  [0402]  (hidden comment: Chip resistor)
R23  value 37.4K  [0402]  (hidden comment: Chip resistor)
R24  value 27K  [0402]  (hidden comment: Chip resistor)
R25  value 422K  [0402]  (hidden comment: Chip resistor)
R26  value 270K  [0402]  (hidden comment: Chip resistor)
U12  MIC861  [SC70-5]
U13  MIC863  [TSOP65P280X145-8N]
U14  ADG849  Supplier Part Number 1: ADG849YKSZ500RLCT-ND  [SC70-6]
U15  TS881  [SC70-5]

### Ports
ADC0, ADC0_SEL, INTEGRATOR (out), OP1_NEGIN (in)

### Nets
GND: C39.2 C40.2 C41.2 C42.2 C43.2 C44.2 C45.2 C46.2 C47.2 R25.2 R26.2 U12.2(V-) U13.4(V-) U14.3(GND) U14.6(S2) U15.2(VEE)
VCC3.3: C40.1 C41.1 C42.1 C43.1 U12.5(V+) U13.8(V+) U14.2(VDD) U15.5(VCC)
VREF: C39.1 C44.1 C45.1 C46.1 U12.1(IN+) U13.3(INA+) U13.5(INB+) U15.4(IN-)
ADC0: U14.5(D) ; port ADC0
AMP1_OUT: C38.1 R16.2 U12.4(OUT)
AMP2_OUT: C36.1 R18.1 U13.1(OUTA)
AMP3_OUT: R20.1 R23.1 U13.7(OUTB) U14.4(S1)
COMP_OUT: R22.2 R24.1 U15.1(OUT)
INTEGRATOR: C47.1 D4.2 R26.1 ; port INTEGRATOR
OP1_NEGIN: C37.1 ; port OP1_NEGIN
NetC36_2: C36.2 R17.1
NetC37_2: C37.2 R19.1
NetC38_2: C38.2 R21.1
NetD4_1: D4.1 R24.2
NetR16_1: R16.1 R19.2 U12.3(IN-)
NetR17_2: R17.2 R20.2 U13.6(INB-)
NetR18_2: R18.2 R21.2 U13.2(INA-)
NetR22_1: R22.1 R23.2 R25.1 U15.3(IN+)
NetU4_2: U14.1(IN) ; port ADC0_SEL

### Notes on the sheet
- VTHR=1.4
- VTHF=1.3
- VREF=1.25
- Title
- Date:
- Author:
- Revision:
- Sheet
- of
- University of Michigan
- File:
- (in symbol ADG849) 0

### Library data of the parts
C36 C38 = C_47p_0402_ceramic: Ceramic capacitor, 47 pF, 0402 package; Manufacture: Johanson; voltage rated: 50 V; tolerance: 5%; package: 0402; Supplier 1: Digi-Key; Supplier Part Number 1: 709-1121-1-ND
C37 = C_1u_0402_ceramic: as C27 on sheet power; package: 0402; Supplier 1: Digi-Key; Supplier Part Number 1: 445-5000-1-ND
C39 C40 C42-C46 = C_0.1u_0402_ceramic: as C4 on sheet impulse; Supplier 1: Digi-Key; Supplier Part Number 1: 445-1265-1-ND; package: 0402
C41 = C_10u_0603_ceramic: as C24 on sheet power; package: 0603; Supplier 1: Digi-Key; Supplier Part Number 1: 445-4112-1-ND
C47 = C_1000p_0402_ceramic: Ceramic capacitor, 1000 pF, 0402 package; Manufacture: TDK; voltage rated: 50 V; tolerance: 10%; package: 0402; Supplier 1: Digi-Key; Supplier Part Number 1: 445-6846-1-ND
D4 = D_SCHOTTKY_30V_0.1A_0603: Schottky diode 30 V 0.1 A 0603; package: 0603; Supplier 1: Digi-Key; Supplier Part Number 1: 641-1282-1-ND
R16 R18 R20 = R_1M_0402: as R9 on sheet impulse; Supplier 1: Digi-Key; Supplier Part Number 1: 541-1.00MLCT-ND; package: 0402
R17 R19 R21 = R_100K_0402: as R3 on sheet impulse; Supplier 1: Digi-Key; Supplier Part Number 1: 541-100KLCT-ND; package: 0402
R22 = R_1.24M_0402: Chip resistor, 1.24M, 0402 package; tolerance: 1%; power: 1/16 W; package: 0402; Supplier 1: Digi-Key; Supplier Part Number 1: 541-1.24MLCT-ND
R23 = R_37.4K_0402: Chip resistor, 37.4K, 0402 package; tolerance: 1%; power: 1/16 W; package: 0402; Supplier 1: Digi-Key; Supplier Part Number 1: 541-37.4KLCT-ND
R24 = R_27K_0402: Chip resistor, 27K, 0402 package; tolerance: 1%; power: 1/16 W; package: 0402; Supplier 1: Digi-Key; Supplier Part Number 1: 541-27.0KLCT-ND
R25 = R_422K_0402: Chip resistor, 422K, 0402 package; tolerance: 1%; power: 1/16 W; package: 0402; Supplier 1: Digi-Key; Supplier Part Number 1: 541-422KLCT-ND
R26 = R_270K_0402: Chip resistor, 270K, 0402 package; tolerance: 1%; power: 1/16 W; package: 0402; Supplier 1: Digi-Key; Supplier Part Number 1: 541-270KLCT-ND
U12 = MIC861: IC OPAMP 400KHZ 2.7V ULT LP SC70; Supplier 1: Digi-Key; Supplier Part Number 1: 576-2932-1-ND
U13 = MIC863: Dual Ultra Low Power Op Amp in SOT23-8; Supplier 1: Digi-Key; Supplier Part Number 1: 576-2934-1-ND
U14 = ADG849: 0.5 Ω SPDT/2:1 Mux in SC70; Supplier 1: Digi-Key
U15 = TS881: Rail-to-rail 1.1 V nanopower comparator; Supplier 1: Digi-Key; Supplier Part Number 1: 497-13217-1-ND

## Sheet ultrasonic_tx.SchDoc: OPO
size Letter; Author: Kuo, Huang; Revision: 4.0; SheetNumber: 7; SheetTotal: 7
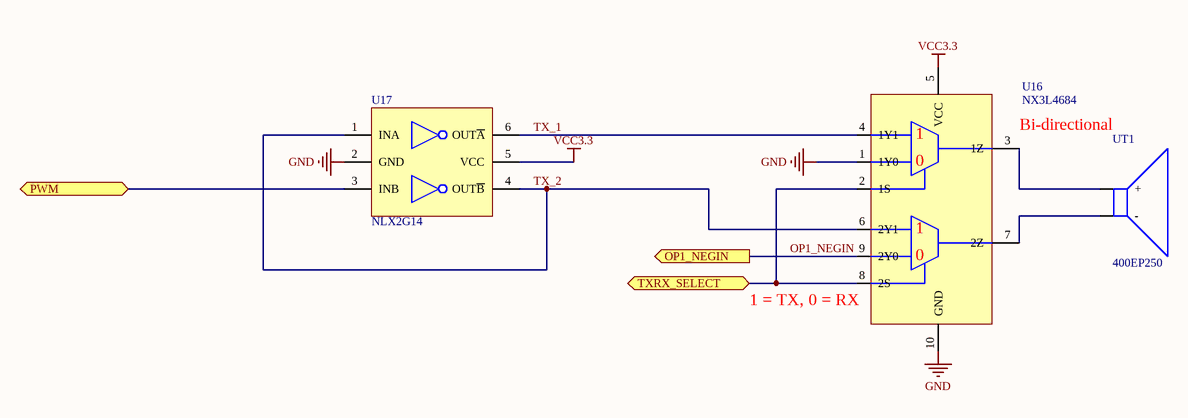
[diagram p6: ultrasonic_tx.SchDoc]

### Parts
U16  NX3L4684  [QFN50P155X200X13-10N]
U17  NLX2G14  [ULLGA6]
UT1  400EP250  [Transducer recepticle]

### Ports
OP1_NEGIN (out), PWM, TXRX_SELECT

### Nets
GND: U16.1(1Y0) U16.10(GND) U17.2(GND)
VCC3.3: U16.5(VCC) U17.5(VCC)
OP1_NEGIN: U16.9(2Y0) ; port OP1_NEGIN
TX_1: U16.4(1Y1) U17.6(OUT~{A})
TX_2: U16.6(2Y1) U17.1(INA) U17.4(OUT~{B})
NetU4_18: U17.3(INB) ; port PWM
NetU4_44: U16.2(1S) U16.8(2S) ; port TXRX_SELECT
NetU16_3: U16.3(1Z) UT1.2(+)
NetU16_7: U16.7(2Z) UT1.1(-)

### Notes on the sheet
- (near U16) Bi-directional
- (near U16) 1 = TX, 0 = RX
- Title
- Date:
- Author:
- Revision:
- Sheet
- of
- University of Michigan
- File:
- (in symbol NX3L4684) 0

### Library data of the parts
U16 = NX3L4684: IC ANALOG SWITCH SPDT 10XQFN; Supplier 1: Digi-Key; Supplier Part Number 1: 568-5564-1-ND
U17 = NLX2G14: Dual Schmitt-Trigger  Inverter; Supplier 1: Digi-Key; Supplier Part Number 1: NLX2G14AMX1TCGOSCT-ND
UT1 = Tranducer: Air Ultrasounic Ceramic Transducers; Supplier 1: Digi-Key; Supplier Part Number 1: ED90088-ND

## Nets that join several sheets
GND: impulse (36 pins), accero_humid_rtc (8 pins), power (9 pins), programming (14 pins), ultrasonic_rx (16 pins), ultrasonic_tx (U16.1 U16.10 U17.2)
VBAT: power (C27.1 J1.2 U9.1 U9.3), programming (C31.1 U10.5)
VCC3.3: impulse (14 pins), accero_humid_rtc (9 pins), power (6 pins), ultrasonic_rx (8 pins), ultrasonic_tx (U16.5 U17.5)
VREF: power (C26.1 U8.2), ultrasonic_rx (8 pins)
ADC0: impulse (U4.59), ultrasonic_rx (U14.5)
INTEGRATOR: impulse (U4.19 U4.36), ultrasonic_rx (C47.1 D4.2 R26.1)
MISO0: impulse (U3.34 U4.30), accero_humid_rtc (U1.7)
MOSI0_MUX: impulse (U3.33 U5.9), accero_humid_rtc (U1.6)
NetU1_8: impulse (U4.21), accero_humid_rtc (U1.8)
NetU1_9: impulse (U4.17), accero_humid_rtc (U1.9)
NetU1_11: impulse (U4.14), accero_humid_rtc (U1.11)
NetU4_2: impulse (U4.2), ultrasonic_rx (U14.1)
NetU4_8: impulse (U4.8), accero_humid_rtc (Y1.2)
NetU4_18: impulse (U4.18), ultrasonic_tx (U17.3)
NetU4_39: impulse (U4.39), accero_humid_rtc (Y1.6)
NetU4_44: impulse (U4.44), ultrasonic_tx (U16.2 U16.8)
OP1_NEGIN: ultrasonic_rx (C37.1), ultrasonic_tx (U16.9)
~{RST}/NMI: impulse (R8.1), programming (U11.32)
SCL: impulse (U5.4), accero_humid_rtc (R2.2 U2.6 Y1.8)
SCLK0_MUX: impulse (U3.32 U5.1), accero_humid_rtc (U1.4)
SDA: impulse (U5.6), accero_humid_rtc (R1.2 U2.1 Y1.1)
TCK: impulse (U4.57), programming (U11.31)
UART1_RX: impulse (U4.22 U4.35), programming (U11.30)
UART1_TX: impulse (U4.13 U4.34), programming (U11.2)
VCC3.3_USB: impulse (U4.26), programming (C35.1 D3.1 U11.1 U11.16)